# Altium schematic sheet mbed_programmer_3.SchDoc
size 298 x 212 mm
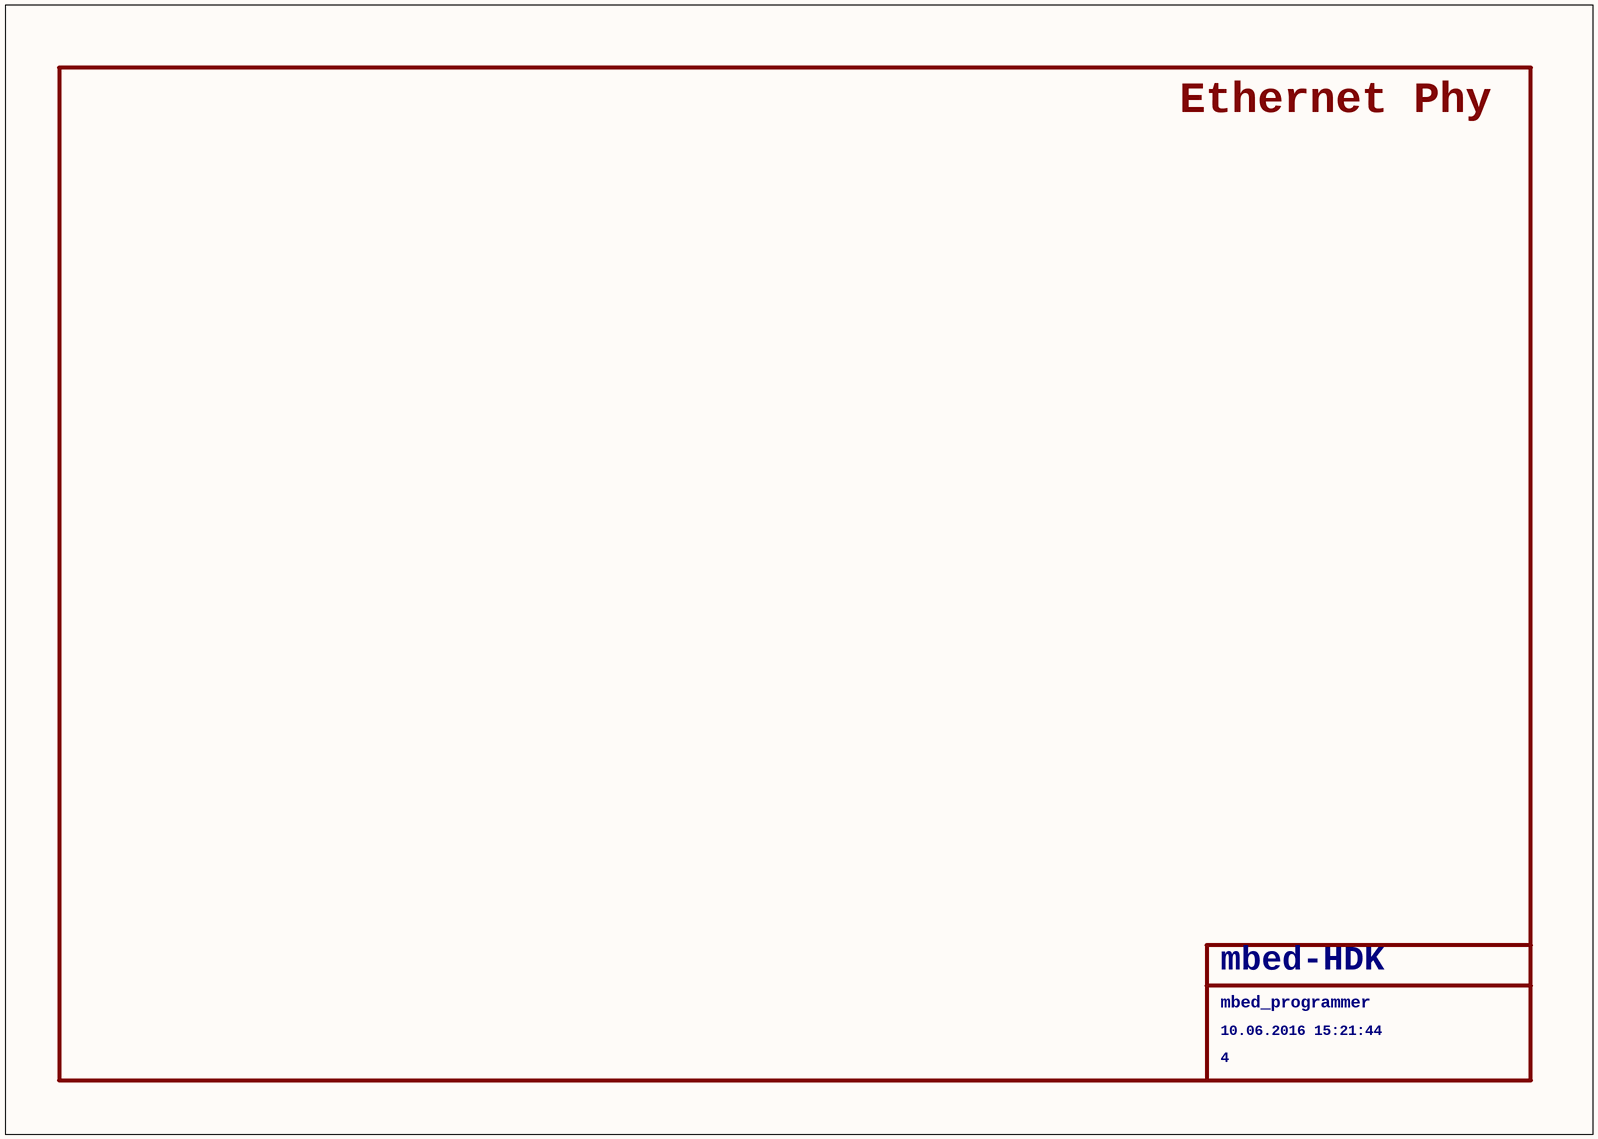
[diagram p0: mbed_programmer_3.SchDoc]

## Parts
U$12  DRAWING_NAME: mbed_programmer  LAST_DATE_TIME: 10.06.2016 15:21:44  SHEET: 4  (hidden comment: MBED_HDK)

## Notes on the sheet
- Ethernet Phy

## Library data of the parts
U$12 = MBED_HDK: mbed-HDK: mbed-HDK